# EAGLE design twip-mb1 (EAGLE 9.2.1)
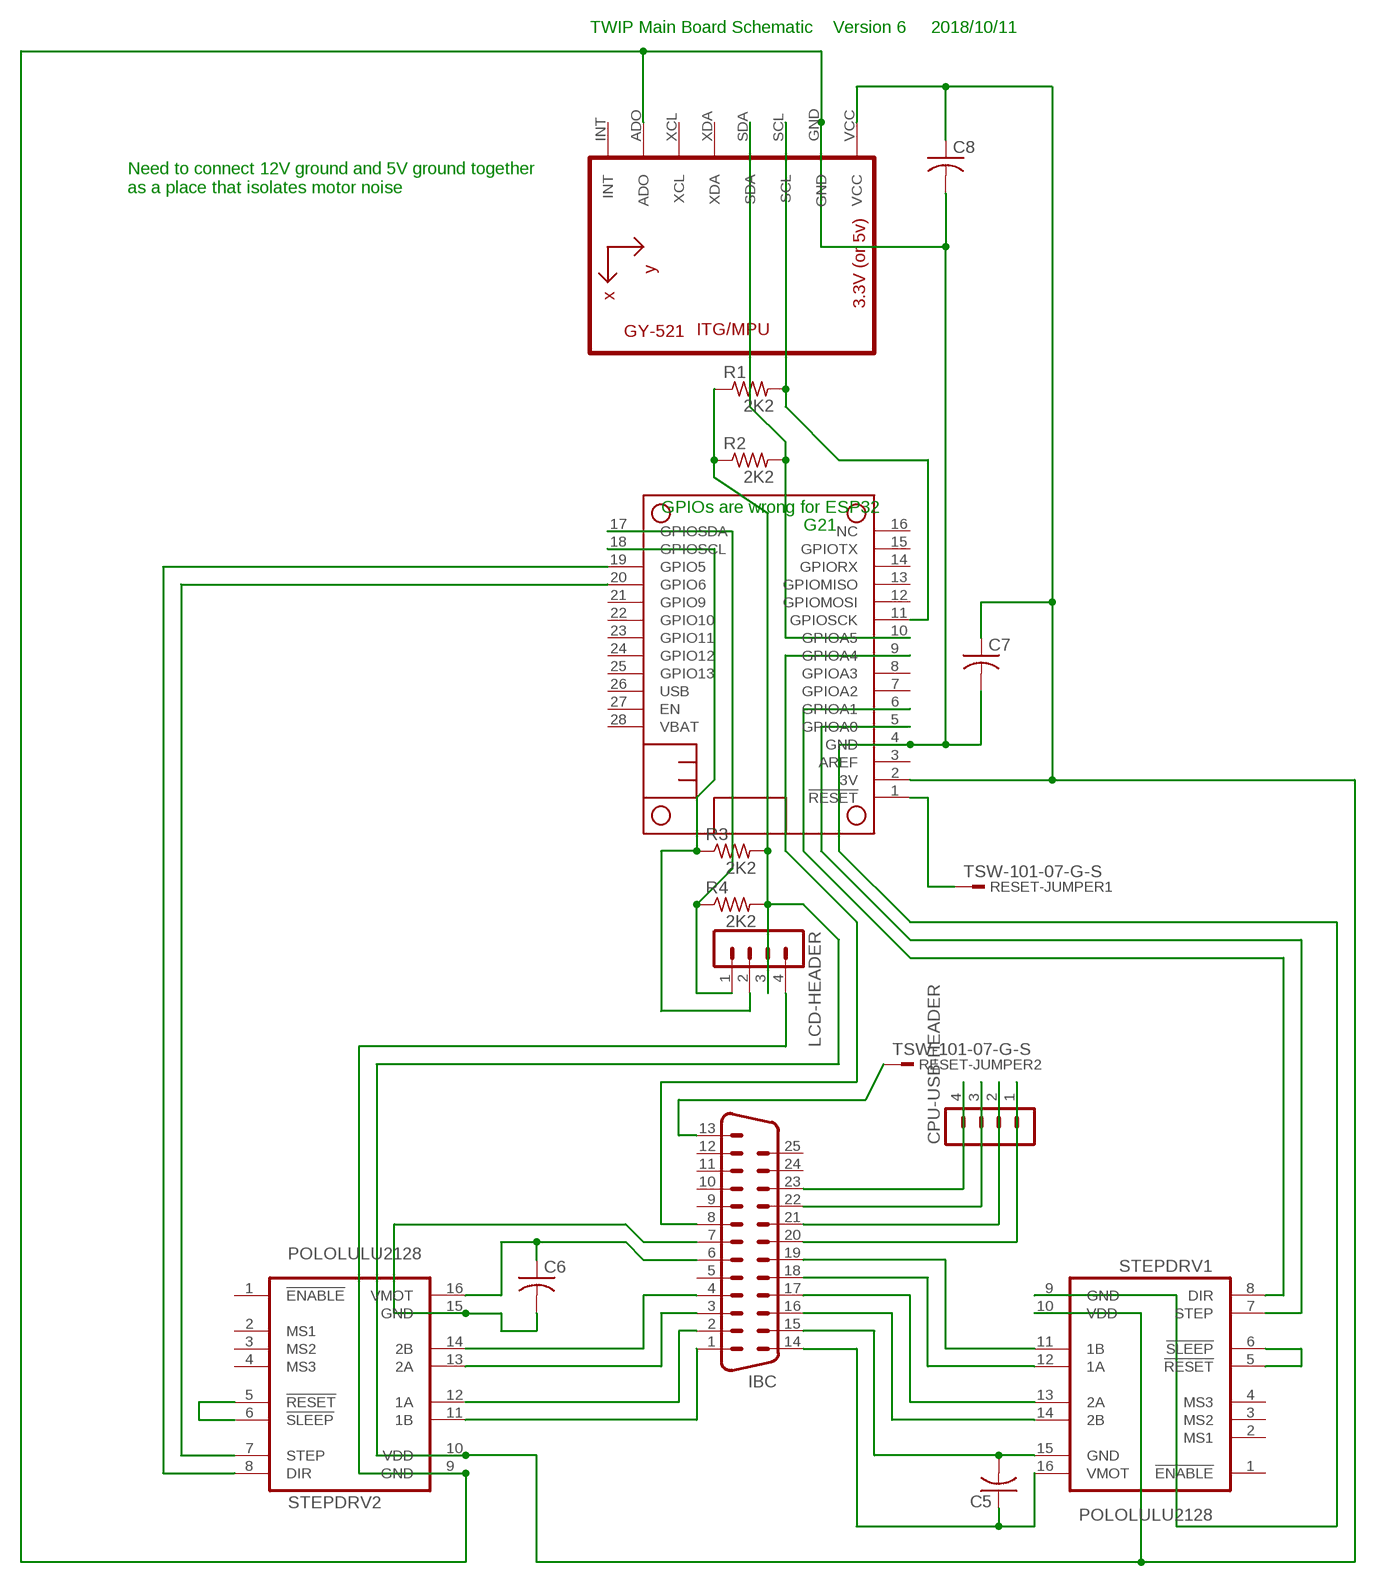
[diagram p0: schematic, sheet 1]

## Parts
C5  C-US050-024X044  [C050-024X044]
C6  C-US050-024X044  [C050-024X044]
C7  C-US050-024X044  [C050-024X044]
C8  C-US050-024X044  [C050-024X044]
CPU-USB-HEADER  MA04-1  [MA04-1]
IBC  M25VP  [M25VP]
LCD-HEADER  MA04-1  [MA04-1]
MS2  FEATHERWING_NOHOLES  [FEATHERWING_NOHOLES]
R1  2K2  R-US_0309/12  [0309/12]
R2  2K2  R-US_0309/12  [0309/12]
R3  2K2  R-US_0309/12  [0309/12]
R4  2K2  R-US_0309/12  [0309/12]
RESET-JUMPER1  TSW-101-07-G-S  [TSW-101-XX-G-S]
RESET-JUMPER2  TSW-101-07-G-S  [TSW-101-XX-G-S]
STEPDRV1  POLOLULU2128  [POLOLULU2128]
STEPDRV2  POLOLULU2128  [POLOLULU2128]
U1  GY-521MPU6050  [GY-521]

## Nets
3V: C7.1 C8.1 LCD-HEADER.3 MS2.2(3V) R1.1 R2.1 R3.2 R4.2 STEPDRV1.10(VDD) STEPDRV2.10(VDD) U1.VCC
N$1: IBC.13 RESET-JUMPER2.1
N$2: C6.2 IBC.7 STEPDRV2.15(GND)
N$3: IBC.16 STEPDRV1.14(2B)
N$4: IBC.17 STEPDRV1.13(2A)
N$5: MS2.5(GPIOA0) STEPDRV1.7(STEP)
N$6: IBC.18 STEPDRV1.12(1A)
N$7: IBC.19 STEPDRV1.11(1B)
N$8: IBC.1 STEPDRV2.11(1B)
N$9: IBC.2 STEPDRV2.12(1A)
N$10: IBC.3 STEPDRV2.13(2A)
N$11: LCD-HEADER.2 MS2.18(GPIOSCL) R3.1
N$12: IBC.4 STEPDRV2.14(2B)
N$13: CPU-USB-HEADER.4 IBC.23
N$14: CPU-USB-HEADER.3 IBC.22
N$15: MS2.6(GPIOA1) STEPDRV1.8(DIR)
N$16: MS2.1(!RESET) RESET-JUMPER1.1
N$17: MS2.11(GPIOSCK) R1.2 U1.SCL
N$18: CPU-USB-HEADER.2 IBC.21
N$19: LCD-HEADER.1 MS2.17(GPIOSDA) R4.1
N$20: C5.2 IBC.15 STEPDRV1.15(GND)
N$21: C6.1 IBC.6 STEPDRV2.16(VMOT)
N$22: C5.1 IBC.14 STEPDRV1.16(VMOT)
N$23: STEPDRV1.5(!RESET) STEPDRV1.6(!SLEEP)
N$24: STEPDRV2.5(!RESET) STEPDRV2.6(!SLEEP)
N$25: MS2.10(GPIOA5) R2.2 U1.SDA
N$27: MS2.19(GPIO5) STEPDRV2.8(DIR)
N$28: IBC.8 MS2.9(GPIOA4)
N$29: MS2.20(GPIO6) STEPDRV2.7(STEP)
N$30: CPU-USB-HEADER.1 IBC.20
N$35: C7.2 C8.2 LCD-HEADER.4 MS2.4(GND) STEPDRV1.9(GND) STEPDRV2.9(GND) U1.ADO U1.GND
Unconnected: IBC.5 IBC.9 IBC.10 IBC.11 IBC.12 IBC.24 IBC.25 IBC.G1 IBC.G2 MS2.3(AREF) MS2.7(GPIOA2) MS2.8(GPIOA3) MS2.12(GPIOMOSI) MS2.13(GPIOMISO) MS2.14(GPIORX) MS2.15(GPIOTX) MS2.16(NC) MS2.21(GPIO9) MS2.22(GPIO10) MS2.23(GPIO11) MS2.24(GPIO12) MS2.25(GPIO13) MS2.26(USB) MS2.27(EN) MS2.28(VBAT) STEPDRV1.1(!ENABLE) STEPDRV1.2(MS1) STEPDRV1.3(MS2) STEPDRV1.4(MS3) STEPDRV2.1(!ENABLE) STEPDRV2.2(MS1) STEPDRV2.3(MS2) STEPDRV2.4(MS3) U1.INT U1.XCL U1.XDA

## Notes on the sheet
- TWIP Main Board Schematic    Version 6     2018/10/11
- Need to connect 12V ground and 5V ground together
  as a place that isolates motor noise
- GPIOs are wrong for ESP32
- G21

## Library data of the parts
C5-C8 = rcl:C-US: CAPACITOR, American symbol; SPICEPREFIX: C
CPU-USB-HEADER LCD-HEADER = con-lstb:MA04-1: PIN HEADER; OC_FARNELL: unknown; OC_NEWARK: unknown
IBC = con-subd:M25VP: SUB-D; OC_FARNELL: unknown; OC_NEWARK: unknown
MS2 = microbuilder:FEATHERWING
R1-R4 = resistor:R-US_: RESISTOR, American symbol
RESET-JUMPER1 RESET-JUMPER2 = con-samtec:TSW-101-*-G-S: THROUGH-HOLE .025" SQ POST HEADER Source: Samtec TSW.pdf; MF: Samtec Inc.; MPN: TSW-101-07-G-S
STEPDRV1 STEPDRV2 = stepper_drivers_etc:POLOLULU2128
U1 = gy-521:GY-521

## Board
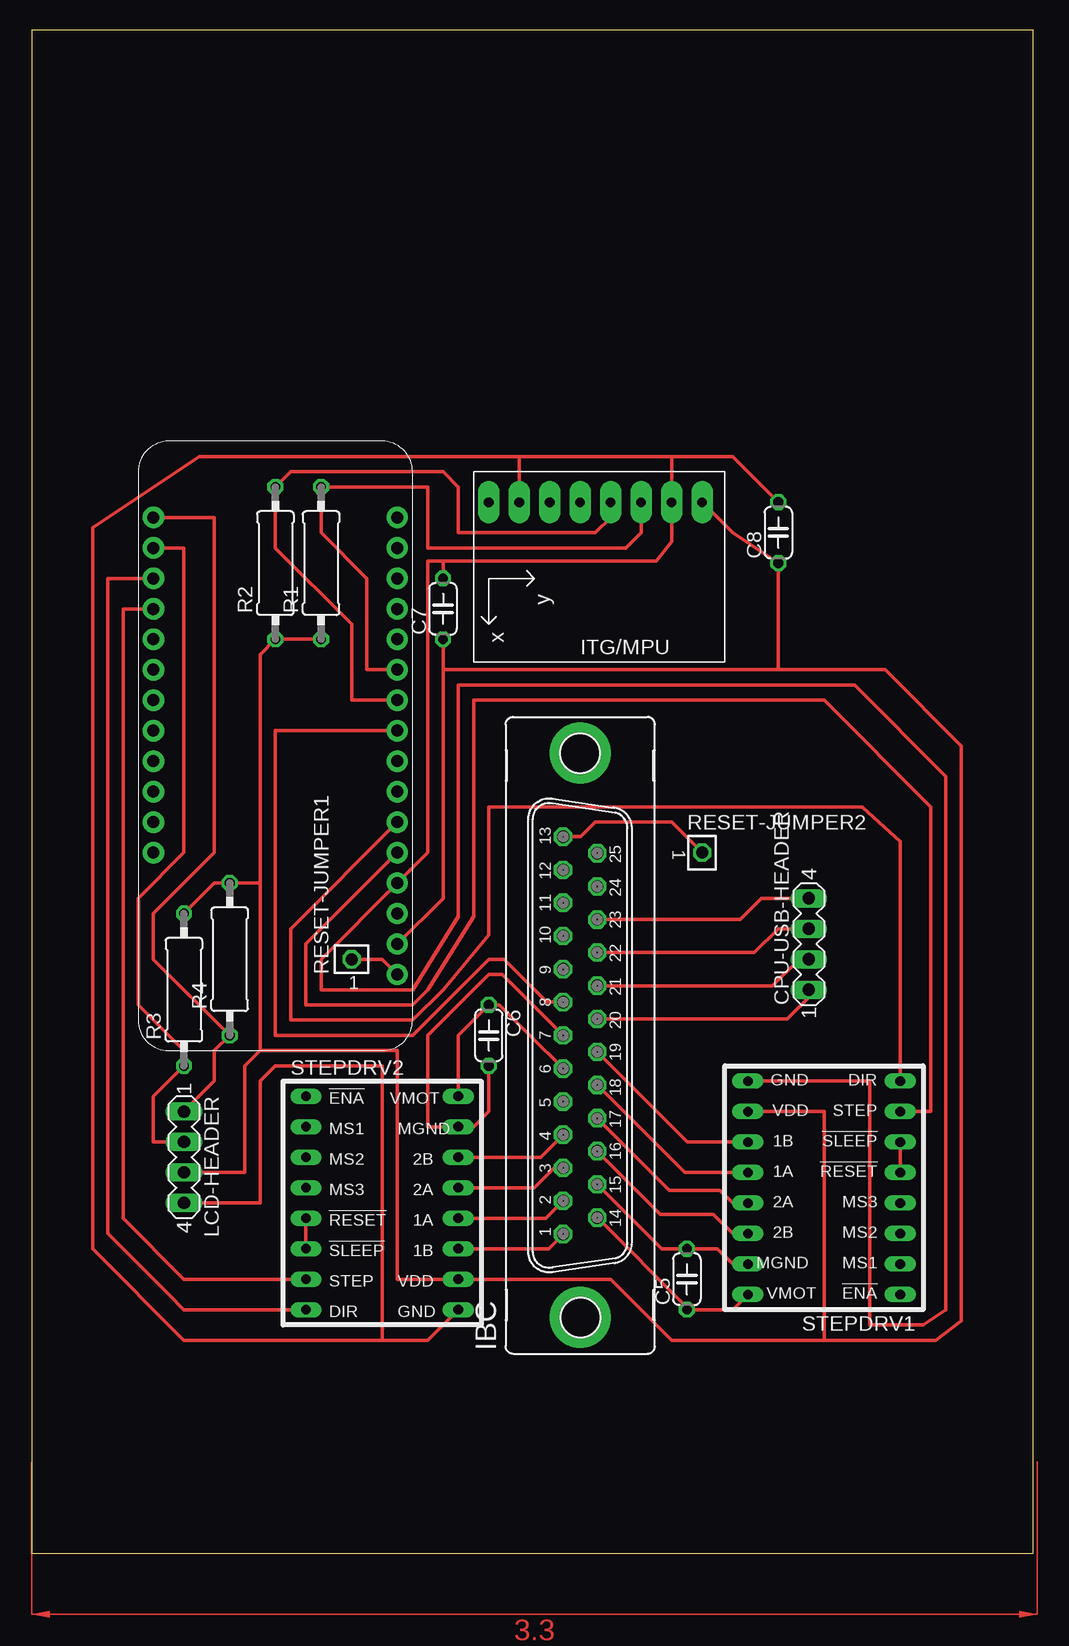
[diagram p1: board, top side]

Size 83.49 x 126.99 mm. Coordinates in mm from the lower left corner, seen from the top.
Outline: 0,0 83.49,0 83.49,126.99 0,126.99 0,0
Copper layers (1*16): Top 0.035mm / dielectric 1.5mm / Bottom 0.035mm
Design rules "default": minimum track width 6mil, minimum drill 0.35mm, track to track 6mil, track to pad 6mil, pad to pad 6mil, via to via 6mil, smd to smd 6mil, copper to edge 40mil, drill to drill 6mil, minimum pad ring 10mil, minimum via ring 8mil, stop-mask expansion 4mil, vias tented up to drill 0mil, thermal gap 10mil

### Footprints (pad centres in the part's own frame; a part is rotated, then mirrored left to right if it is on the bottom)
C050-024X044 = drill 0.813 octagon: 1 -2.54,0; 2 2.54,0
MA04-1 = drill 1.016 long: 1 -3.81,0; 2 -1.27,0; 3 1.27,0; 4 3.81,0
M25VP = drill 1.016 octagon: 1 -16.561,1.422; 2 -13.792,1.422; 3 -11.049,1.422; 4 -8.28,1.422; 5 -5.512,1.422; 6 -2.769,1.422; 7 0,1.422; 8 2.769,1.422; 9 5.512,1.422; 10 8.28,1.422; 11 11.049,1.422; 12 13.792,1.422; 13 16.561,1.422; 14 -15.189,-1.422; 15 -12.421,-1.422; 16 -9.652,-1.422; 17 -6.909,-1.422; 18 -4.14,-1.422; 19 -1.372,-1.422; 20 1.372,-1.422; 21 4.14,-1.422; 22 6.909,-1.422; 23 9.652,-1.422; 24 12.421,-1.422; 25 15.189,-1.422 | drill 3.302 pad 5.08: G1 -23.52,0; G2 23.52,0
FEATHERWING_NOHOLES = drill 1 pad 1.778: 1 6.35,1.27; 2 8.89,1.27; 3 11.43,1.27; 4 13.97,1.27; 5 16.51,1.27; 6 19.05,1.27; 7 21.59,1.27; 8 24.13,1.27; 9 26.67,1.27; 10 29.21,1.27; 11 31.75,1.27; 12 34.29,1.27; 13 36.83,1.27; 14 39.37,1.27; 15 41.91,1.27; 16 44.45,1.27; 17 44.45,21.59; 18 41.91,21.59; 19 39.37,21.59; 20 36.83,21.59; 21 34.29,21.59; 22 31.75,21.59; 23 29.21,21.59; 24 26.67,21.59; 25 24.13,21.59; 26 21.59,21.59; 27 19.05,21.59; 28 16.51,21.59
0309/12 = drill 0.813 octagon: 1 -6.35,0; 2 6.35,0
TSW-101-XX-G-S = drill 1 pad 1.5 octagon: 1 0,0
POLOLULU2128 = drill 0.8 long: 1 -7.62,7.62; 2 -7.62,5.08; 3 -7.62,2.54; 4 -7.62,0; 5 -7.62,-2.54; 6 -7.62,-5.08; 7 -7.62,-7.62; 8 -7.62,-10.16; 9 5.08,-10.16; 10 5.08,-7.62; 11 5.08,-5.08; 12 5.08,-2.54; 13 5.08,0; 14 5.08,2.54; 15 5.08,5.08; 16 5.08,7.62
GY-521 = drill 0.8 pad 1.778 long: ADO -8.89,-6.35; GND -8.89,6.35; INT -8.89,-8.89; SCL -8.89,3.81; SDA -8.89,1.27; VCC -8.89,8.89; XCL -8.89,-3.81; XDA -8.89,-1.27

### Placement (x,y rotation side)
C5  54.61,22.86 90 top
C6  38.1,43.18 270 top
C7  34.29,78.74 90 top
C8  62.23,85.09 90 top
CPU-USB-HEADER  64.77,50.8 90 top
IBC  45.72,43.18 90 top
LCD-HEADER  12.7,33.02 270 top
MS2  31.75,41.91 90 top
R1  24.13,82.55 90 top
R2  20.32,82.55 90 top
R3  12.7,46.99 90 top
R4  16.51,49.53 90 top
RESET-JUMPER1  26.67,49.53 0 top
RESET-JUMPER2  55.88,58.42 270 top
STEPDRV1  64.77,29.21 180 top
STEPDRV2  30.48,30.48 0 top
U1  46.99,78.74 270 top

### Tracks (layer width: path | path; a pad name or v marks a point on that pad's centre or on a via)
3V
  Top 0.305: MS2.2 34.29,54.61 34.29,73.66 | STEPDRV1.10 66.04,36.83 66.04,17.78 | 66.04,17.78 75.35,17.78 77.47,19.37 77.47,67.31 71.12,73.66 62.23,73.66 | 34.29,73.66 62.23,73.66 | 66.04,17.78 53.34,17.78 48.26,22.86 STEPDRV2.10 30.48,22.86 30.48,41.91 19.05,41.91 | LCD-HEADER.3 17.78,31.75 17.78,40.64 19.05,41.91 | U1.VCC 58.42,85.09 C8.1 62.23,73.66 | C7.1 34.29,73.66 | 19.05,41.91 19.05,55.88 | 19.05,55.88 19.05,74.93 R2.1 R1.1 | R3.2 15.24,55.88 R4.2 19.05,55.88
N$1
  Top 0.305: IBC.13 45.77,59.74 46.99,60.96 53.34,60.96 RESET-JUMPER2.1
N$2
  Top 0.305: IBC.7 39.22,48.26 38.1,48.26 33.02,43.18 33.02,35.56 STEPDRV2.15 36.83,35.56 38.1,36.83 C6.2
N$3
  Top 0.305: IBC.16 52.4,28.27 56.82,28.27 58.42,26.67 STEPDRV1.14
N$4
  Top 0.305: IBC.17 53.14,30.28 55.88,30.28 57.35,30.28 58.42,29.21 STEPDRV1.13
N$5
  Top 0.305: STEPDRV1.7 74.93,36.83 74.93,62.23 66.04,71.12 36.83,71.12 36.83,53.09 33.02,46.99 31.75,45.72 22.86,45.72 22.86,50.8 MS2.5
N$6
  Top 0.305: IBC.18 54.43,31.75 STEPDRV1.12
N$7
  Top 0.305: IBC.19 54.66,34.29 STEPDRV1.11
N$8
  Top 0.305: 44.25,26.67 IBC.1 43.08,25.4 STEPDRV2.11
N$9
  Top 0.305: 44.12,29.21 IBC.2 42.85,27.94 STEPDRV2.12
N$10
  Top 0.305: 43.92,31.75 IBC.3 43.56,32.13 41.91,30.48 STEPDRV2.13
N$11
  Top 0.305: 13.97,34.29 LCD-HEADER.2 10.16,34.29 10.16,38.1 R3.1 12.7,41.91 8.89,45.72 8.89,54.61 12.7,58.42 12.7,83.82 MS2.18
N$12
  Top 0.305: IBC.4 42.42,33.02 STEPDRV2.14
N$13
  Top 0.305: IBC.23 59.05,52.83 60.82,54.61 CPU-USB-HEADER.4
N$14
  Top 0.305: IBC.22 60.22,50.09 62.2,52.07 CPU-USB-HEADER.3
N$15
  Top 0.305: STEPDRV1.8 72.39,59.34 70.2,61.34 69.22,62.23 38.1,62.23 38.1,51.56 34.29,46.99 31.75,44.45 21.59,44.45 21.59,52.07 MS2.6
N$16
  Top 0.305: RESET-JUMPER1.1 29.21,49.53 MS2.1
N$17
  Top 0.305: U1.SCL 50.8,85.09 49.53,83.82 33.02,83.82 33.02,88.9 R1.2 24.13,85.09 27.94,81.28 27.94,73.66 MS2.11
N$18
  Top 0.305: IBC.21 61.75,47.32 63.95,49.53 CPU-USB-HEADER.2
N$19
  Top 0.305: MS2.17 15.24,86.36 15.24,58.42 10.16,53.34 10.16,49.53 R4.1 15.24,41.91 15.24,39.37 LCD-HEADER.1
N$20
  Top 0.305: IBC.15 52.5,25.4 C5.2 57.15,25.4 58.42,24.13 STEPDRV1.15
N$21
  Top 0.305: STEPDRV2.16 35.56,43.18 C6.1 38.99,45.72 41.53,43.18 IBC.6
N$22
  Top 0.305: IBC.14 54.61,20.52 C5.1 58.42,20.32 STEPDRV1.16
N$23
  Top 0.305: STEPDRV1.6 STEPDRV1.5
N$24
  Top 0.305: STEPDRV2.5 STEPDRV2.6
N$25
  Top 0.305: U1.SDA 48.26,86.36 46.99,85.09 35.56,85.09 35.56,88.9 34.29,90.17 21.59,90.17 R2.2 20.32,83.82 26.67,77.47 26.67,71.12 MS2.10
N$27
  Top 0.305: MS2.19 6.35,81.28 6.35,26.67 11.43,21.59 12.7,20.32 STEPDRV2.8
N$28
  Top 0.305: IBC.8 42.95,45.95 40.64,48.26 39.37,49.53 38.1,49.53 31.75,43.18 20.32,43.18 20.32,68.58 MS2.9
N$29
  Top 0.305: MS2.20 7.62,78.74 7.62,27.94 12.7,22.86 STEPDRV2.7
N$30
  Top 0.305: IBC.20 62.98,44.55 64.77,46.34 CPU-USB-HEADER.1
N$35
  Top 0.305: 53.34,91.44 U1.GND 53.34,84.36 52.07,82.73 34.29,82.73 | 34.29,82.73 33.02,82.73 33.02,58.42 MS2.4 24.13,49.53 24.13,46.99 31.75,46.99 35.56,53.09 35.56,72.39 68.58,72.39 76.2,64.77 76.2,20.32 74.3,19.05 69.85,19.05 69.85,39.37 STEPDRV1.9 | 53.34,91.44 40.64,91.44 | 40.64,91.44 13.97,91.44 5.08,85.51 5.08,25.4 12.7,17.78 29.21,17.78 | 29.21,17.78 33.02,17.78 STEPDRV2.9 | LCD-HEADER.4 19.05,29.21 19.05,39.37 20.32,40.64 29.21,40.64 29.21,17.78 | U1.ADO 40.64,91.44 | C8.2 58.42,91.44 53.34,91.44 | C7.2 34.29,82.73
(copper drawn outside any net)
  shapes: Top area x2